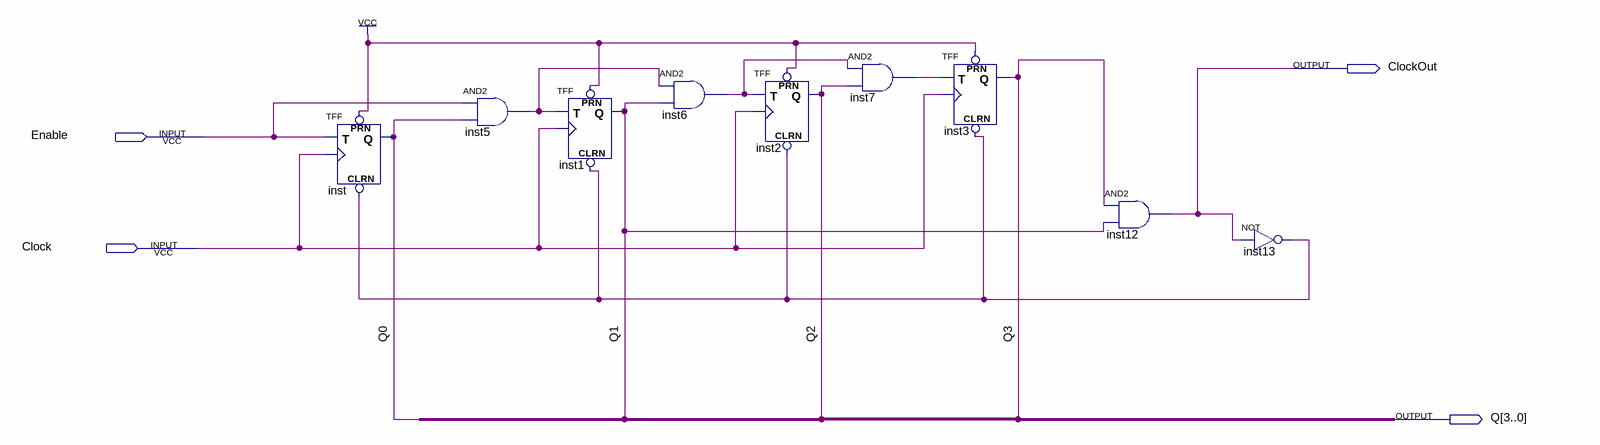
[diagram p0: schematic sheet]
// Quartus schematic divideByTenCounter.bdf as structural Verilog: 9 symbols, 4 pins
module divideByTenCounter (
  input  Enable,
  input  Clock,
  output ClockOut,
  output [3:0] Q
);

  wire inst5_out, inst6_out, inst7_out, inst13_out;

  TFF inst (.PRN(1'b1), .CLRN(inst13_out), .T(Enable), .CLK(Clock), .Q(Q[0]));
  and inst5 (inst5_out, Enable, Q[0]);
  TFF inst1 (.PRN(1'b1), .CLRN(inst13_out), .T(inst5_out), .CLK(Clock), .Q(Q[1]));
  and inst6 (inst6_out, inst5_out, Q[1]);
  TFF inst2 (.PRN(1'b1), .CLRN(inst13_out), .T(inst6_out), .CLK(Clock), .Q(Q[2]));
  and inst7 (inst7_out, inst6_out, Q[2]);
  TFF inst3 (.PRN(1'b1), .CLRN(inst13_out), .T(inst7_out), .CLK(Clock), .Q(Q[3]));
  and inst12 (ClockOut, Q[3], Q[1]);
  not inst13 (inst13_out, ClockOut);
endmodule
